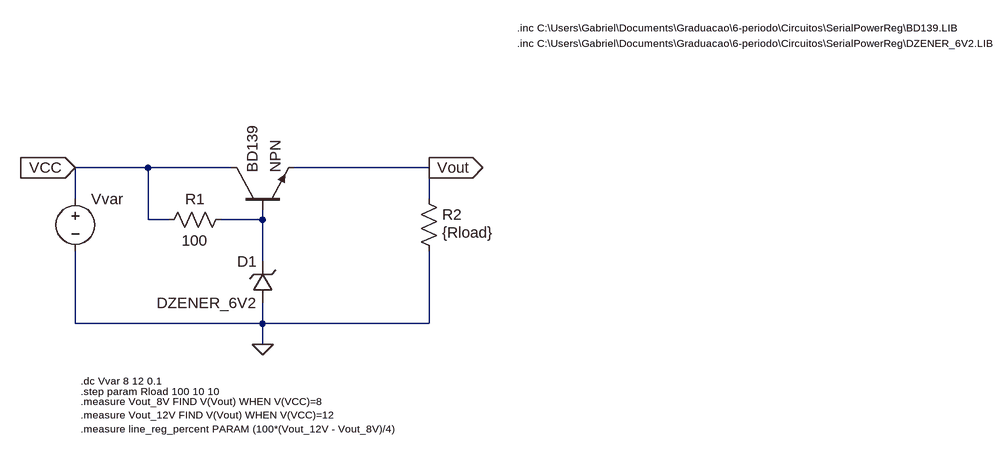
[diagram p0: schematic serialReg.asc]
serialReg.asc, the LTspice schematic file:
Version 4.1
SHEET 1 1652 680
WIRE 16 80 -96 80
WIRE 144 80 16 80
WIRE 448 80 240 80
WIRE -96 128 -96 80
WIRE 448 128 448 80
WIRE 16 160 16 80
WIRE 48 160 16 160
WIRE 192 160 192 144
WIRE 192 160 128 160
WIRE 192 224 192 160
WIRE -96 320 -96 208
WIRE 192 320 192 288
WIRE 192 320 -96 320
WIRE 448 320 448 208
WIRE 448 320 192 320
WIRE 192 352 192 320
FLAG 192 352 0
FLAG 448 80 Vout
IOPIN 448 80 Out
FLAG -96 80 VCC
IOPIN -96 80 In
SYMBOL npn 144 144 R270
SYMATTR InstName BD139
SYMBOL voltage -96 112 R0
WINDOW 123 0 0 Left 0
WINDOW 39 0 0 Left 0
SYMATTR InstName Vvar
SYMATTR Value ""
SYMBOL res 144 144 R90
WINDOW 0 0 56 VBottom 2
WINDOW 3 32 56 VTop 2
SYMATTR InstName R1
SYMATTR Value 100
SYMATTR SpiceLine pwr=1
SYMBOL zener 208 288 R180
WINDOW 0 24 64 Left 2
WINDOW 3 24 0 Left 2
SYMATTR InstName D1
SYMATTR Value DZENER_6V2
SYMBOL res 432 112 R0
WINDOW 3 36 68 Left 2
SYMATTR Value {Rload}
SYMATTR InstName R2
TEXT 584 -136 Left 1 !.inc C:\\Users\\Gabriel\\Documents\\Graduacao\\6-periodo\\Circuitos\\SerialPowerReg\\BD139.LIB
TEXT 584 -112 Left 1 !.inc C:\\Users\\Gabriel\\Documents\\Graduacao\\6-periodo\\Circuitos\\SerialPowerReg\\DZENER_6V2.LIB
TEXT -88 408 Left 1 !.dc Vvar 8 12 0.1
TEXT -88 424 Left 1 !.step param Rload 100 10 10
TEXT -88 440 Left 1 !.measure Vout_8V FIND V(Vout) WHEN V(VCC)=8\n.measure Vout_12V FIND V(Vout) WHEN V(VCC)=12\n.measure line_reg_percent PARAM (100*(Vout_12V - Vout_8V)/4)

The netlist it stands for:
* serialReg.asc
Q§BD139 VCC N001 Vout 0 NPN
Vvar VCC 0
R1 N001 VCC 100 pwr=1
D1 0 N001 DZENER_6V2
R2 Vout 0 {Rload}
.model D D
.lib standard.dio
.model NPN NPN
.model PNP PNP
.lib standard.bjt
.inc C:\Users\Gabriel\Documents\Graduacao\6-periodo\Circuitos\SerialPowerReg\BD139.LIB
.inc C:\Users\Gabriel\Documents\Graduacao\6-periodo\Circuitos\SerialPowerReg\DZENER_6V2.LIB
.dc Vvar 8 12 0.1
.step param Rload 100 10 10
.measure Vout_8V FIND V(Vout) WHEN V(VCC)=8
.measure Vout_12V FIND V(Vout) WHEN V(VCC)=12
.measure line_reg_percent PARAM (100*(Vout_12V - Vout_8V)/4)
.backanno
.end

* Results of the author's LTspice run, read from the files saved beside the schematic
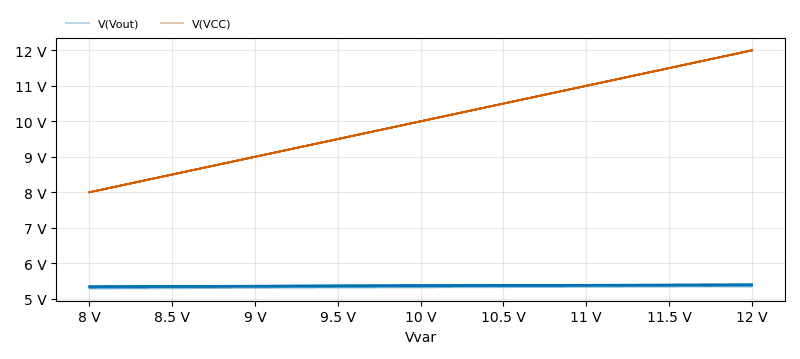
[diagram p1: DC transfer characteristic of serialReg.asc, plotted from the saved traces]
* DC transfer characteristic, 10 runs:
*   V(Vout) [run 1]: 5.278 V at Vvar=8 V, 5.337 V at Vvar=12 V, min 5.278 V, max 5.337 V
*   V(Vout) [run 2]: 5.302 V at Vvar=8 V, 5.358 V at Vvar=12 V, min 5.302 V, max 5.358 V
*   V(Vout) [run 3]: 5.314 V at Vvar=8 V, 5.369 V at Vvar=12 V, min 5.314 V, max 5.369 V
*   V(Vout) [run 4]: 5.322 V at Vvar=8 V, 5.377 V at Vvar=12 V, min 5.322 V, max 5.377 V
*   V(Vout) [run 5]: 5.329 V at Vvar=8 V, 5.383 V at Vvar=12 V, min 5.329 V, max 5.383 V
*   V(Vout) [run 6]: 5.334 V at Vvar=8 V, 5.388 V at Vvar=12 V, min 5.334 V, max 5.388 V
*   V(Vout) [run 7]: 5.338 V at Vvar=8 V, 5.392 V at Vvar=12 V, min 5.338 V, max 5.392 V
*   V(Vout) [run 8]: 5.341 V at Vvar=8 V, 5.396 V at Vvar=12 V, min 5.341 V, max 5.396 V
*   V(VCC) [run 1]: 8 V at Vvar=8 V, 12 V at Vvar=12 V, min 8 V, max 12 V
*   V(VCC) [run 2]: 8 V at Vvar=8 V, 12 V at Vvar=12 V, min 8 V, max 12 V
*   V(VCC) [run 3]: 8 V at Vvar=8 V, 12 V at Vvar=12 V, min 8 V, max 12 V
*   V(VCC) [run 4]: 8 V at Vvar=8 V, 12 V at Vvar=12 V, min 8 V, max 12 V
*   V(VCC) [run 5]: 8 V at Vvar=8 V, 12 V at Vvar=12 V, min 8 V, max 12 V
*   V(VCC) [run 6]: 8 V at Vvar=8 V, 12 V at Vvar=12 V, min 8 V, max 12 V
*   V(VCC) [run 7]: 8 V at Vvar=8 V, 12 V at Vvar=12 V, min 8 V, max 12 V
*   V(VCC) [run 8]: 8 V at Vvar=8 V, 12 V at Vvar=12 V, min 8 V, max 12 V
* From the log:
*   Measurement: vout_8v
*     step  V(Vout)  at
*        1  5.27752733231  8
*        2  5.30159568787  8
*        3  5.31394529343  8
*        4  5.32228183746  8
*        5  5.32857751846  8
*        6  5.3336353302  8
*        7  5.33786249161  8
*        8  5.34149312973  8
*        9  5.34467506409  8
*       10  5.34750699997  8
*   Measurement: vout_12v
*     step  V(Vout)  at
*        1  5.33741378784  12
*        2  5.35806894302  12
*        3  5.36943340302  12
*        4  5.37730121613  12
*        5  5.38332223892  12
*        6  5.38820028305  12
*        7  5.39230012894  12
*        8  5.3958363533  12
*        9  5.39894485474  12
*       10  5.40171861649  12
*   Measurement: line_reg_percent
*     step  (100*(Vout_12V - Vout_8V)/4)
*        1  1.4971613884
*        2  1.41183137894
*        3  1.38720273972
*        4  1.37548446655
*        5  1.36861801147
*        6  1.36412382126
*        7  1.36094093323
*        8  1.35858058929
*        9  1.35674476624
*       10  1.3552904129